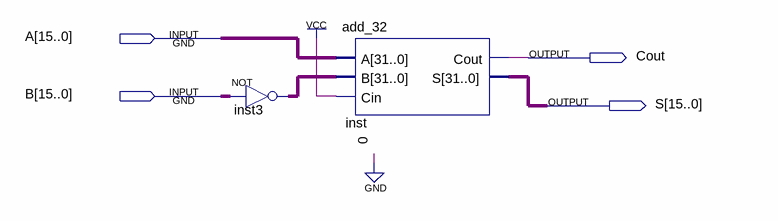
[diagram p0: schematic sheet]
// Quartus schematic sub16.bdf as structural Verilog: 2 symbols, 4 pins
module sub16 (
  input  [15:0] A,
  input  [15:0] B,
  output Cout,
  output [31:0] S
);

  wire [15:0] nb;

  assign nb = ~B;  // NOT inst3, 16 bits wide
  add_32 inst (.A({{16{1'b0}}, A}), .B({{16{1'b0}}, nb}), .Cin(1'b1), .Cout(Cout), .S(S));
endmodule
